# EAGLE design Voltage Converter v1 (EAGLE 6.5.0)
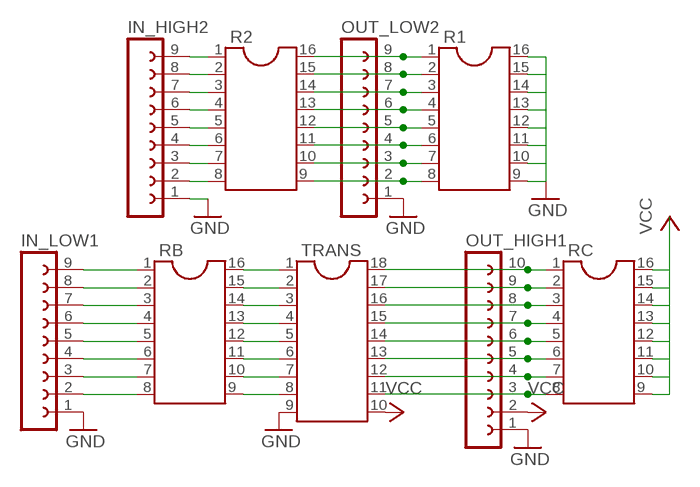
[diagram p0: schematic, sheet 1]

## Parts
IN_HIGH2  FE09-1  [FE09]
IN_LOW1  FE09-1  [FE09]
OUT_HIGH1  FE10-1  [FE10]
OUT_LOW2  FE09-1  [FE09]
R1  DIL16S  [SOCKET-16]
R2  DIL16S  [SOCKET-16]
RB  DIL16S  [SOCKET-16]
RC  DIL16S  [SOCKET-16]
TRANS  DIL18S  [SOCKET-18]

## Nets
GND: IN_HIGH2.1 IN_LOW1.1 OUT_HIGH1.1 OUT_LOW2.1 R1.9 R1.10 R1.11 R1.12 R1.13 R1.14 R1.15 R1.16 TRANS.9
N$1: IN_LOW1.2 RB.8
N$2: IN_LOW1.3 RB.7
N$3: IN_LOW1.4 RB.6
N$4: IN_LOW1.5 RB.5
N$5: IN_LOW1.6 RB.4
N$6: IN_LOW1.7 RB.3
N$7: IN_LOW1.8 RB.2
N$8: IN_LOW1.9 RB.1
N$9: RB.9 TRANS.8
N$10: RB.10 TRANS.7
N$11: RB.11 TRANS.6
N$12: RB.12 TRANS.5
N$13: RB.13 TRANS.4
N$14: RB.14 TRANS.3
N$15: RB.15 TRANS.2
N$16: RB.16 TRANS.1
N$17: OUT_HIGH1.10 RC.1 TRANS.18
N$18: OUT_HIGH1.9 RC.2 TRANS.17
N$19: OUT_HIGH1.8 RC.3 TRANS.16
N$20: OUT_HIGH1.7 RC.4 TRANS.15
N$21: OUT_HIGH1.6 RC.5 TRANS.14
N$22: OUT_HIGH1.5 RC.6 TRANS.13
N$23: OUT_HIGH1.4 RC.7 TRANS.12
N$24: OUT_HIGH1.3 RC.8 TRANS.11
N$25: IN_HIGH2.2 R2.8
N$26: IN_HIGH2.3 R2.7
N$27: IN_HIGH2.4 R2.6
N$28: IN_HIGH2.5 R2.5
N$29: IN_HIGH2.6 R2.4
N$30: IN_HIGH2.7 R2.3
N$31: IN_HIGH2.8 R2.2
N$32: IN_HIGH2.9 R2.1
N$33: OUT_LOW2.9 R1.1 R2.16
N$34: OUT_LOW2.8 R1.2 R2.15
N$35: OUT_LOW2.7 R1.3 R2.14
N$36: OUT_LOW2.6 R1.4 R2.13
N$37: OUT_LOW2.5 R1.5 R2.12
N$38: OUT_LOW2.4 R1.6 R2.11
N$39: OUT_LOW2.3 R1.7 R2.10
N$40: OUT_LOW2.2 R1.8 R2.9
VCC: OUT_HIGH1.2 RC.9 RC.10 RC.11 RC.12 RC.13 RC.14 RC.15 RC.16 TRANS.10

## Library data of the parts
IN_HIGH2 IN_LOW1 OUT_LOW2 = con-lsta:FE09-1: FEMALE HEADER; OC_FARNELL: unknown; OC_NEWARK: unknown
OUT_HIGH1 = con-lsta:FE10-1: FEMALE HEADER; OC_FARNELL: unknown; OC_NEWARK: unknown
R1 R2 RB RC = ic-package:DIL16: Dual In Line / Socket
TRANS = ic-package:DIL18: Dual In Line / Socket

## Board
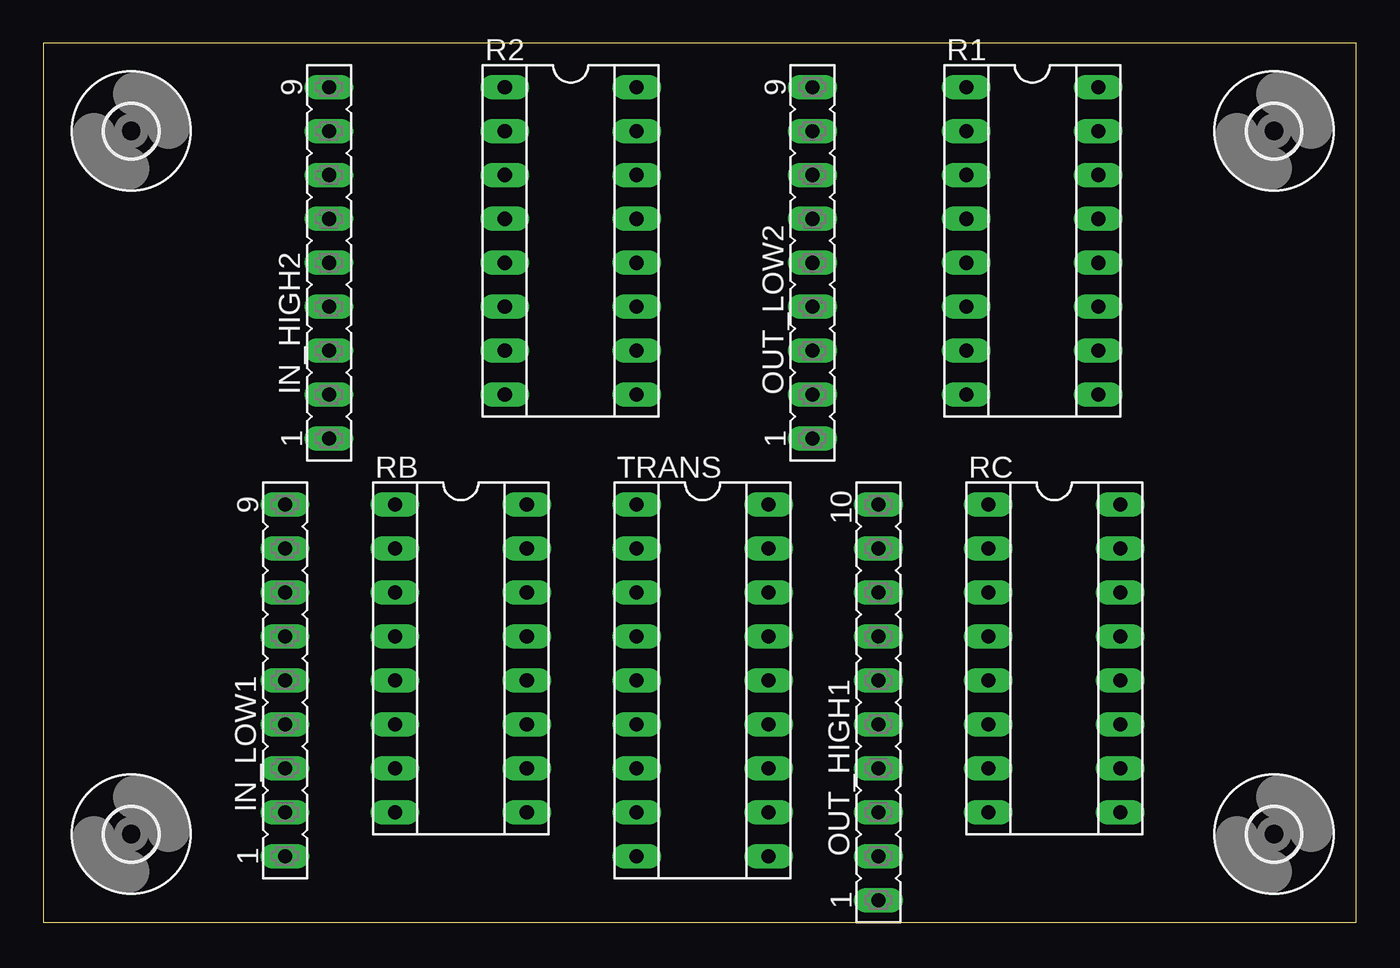
[diagram p1: board, top side]
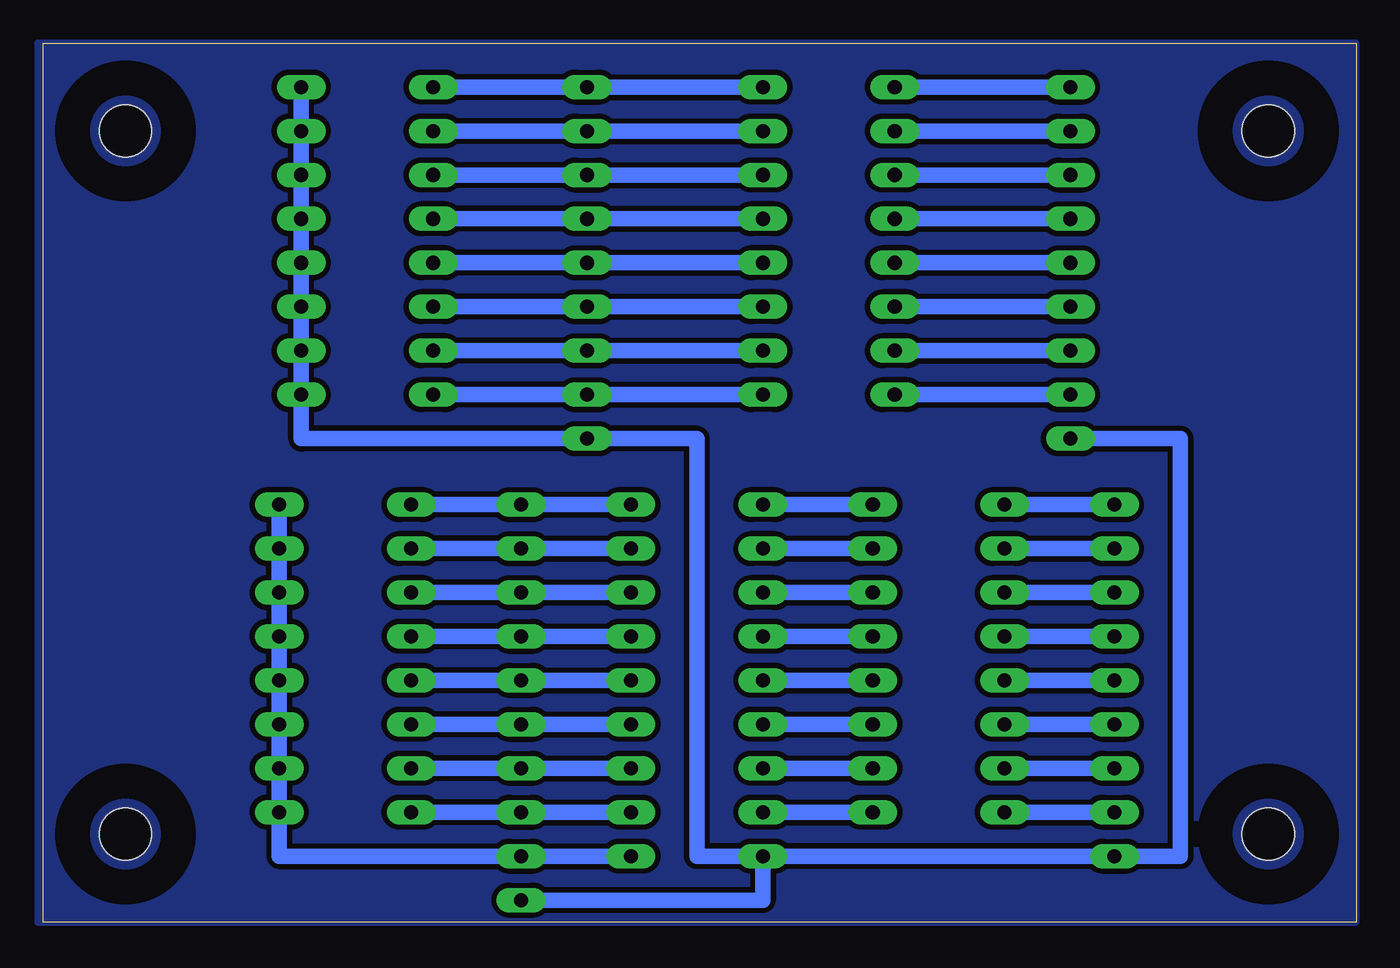
[diagram p2: board, bottom side, seen from below]

Size 75.87 x 50.79 mm. Coordinates in mm from the lower left corner, seen from the top.
Outline: 0,0 75.87,0 75.87,50.79 0,50.79 0,0
Copper layers (1*16): Top 0.035mm / dielectric 1.5mm / Bottom 0.035mm
Design rules "default *": minimum track width 12mil, minimum drill 24mil, track to track 12mil, track to pad 12mil, pad to pad 12mil, via to via 12mil, smd to smd 8mil, copper to edge 0mil, drill to drill 8mil, minimum pad ring 12mil, minimum via ring 12mil, stop-mask expansion 4mil, vias tented up to drill 0mil, thermal gap 10mil
tKeepout: area -1.3,-1.3 to 77.5,52.1
tRestrict: area -1.3,-1.3 to 77.5,52.1

### Footprints (pad centres in the part's own frame; a part is rotated, then mirrored left to right if it is on the bottom)
FE09 = drill 0.813 long: 1 -10.16,0; 2 -7.62,0; 3 -5.08,0; 4 -2.54,0; 5 0,0; 6 2.54,0; 7 5.08,0; 8 7.62,0; 9 10.16,0
FE10 = drill 0.813 long: 1 -11.43,0; 2 -8.89,0; 3 -6.35,0; 4 -3.81,0; 5 -1.27,0; 6 1.27,0; 7 3.81,0; 8 6.35,0; 9 8.89,0; 10 11.43,0
SOCKET-16 = drill 0.813 long: 1 -8.89,-3.81; 2 -6.35,-3.81; 3 -3.81,-3.81; 4 -1.27,-3.81; 5 1.27,-3.81; 6 3.81,-3.81; 7 6.35,-3.81; 8 8.89,-3.81; 9 8.89,3.81; 10 6.35,3.81; 11 3.81,3.81; 12 1.27,3.81; 13 -1.27,3.81; 14 -3.81,3.81; 15 -6.35,3.81; 16 -8.89,3.81
SOCKET-18 = drill 0.813 long: 1 -10.16,-3.81; 2 -7.62,-3.81; 3 -5.08,-3.81; 4 -2.54,-3.81; 5 0,-3.81; 6 2.54,-3.81; 7 5.08,-3.81; 8 7.62,-3.81; 9 10.16,-3.81; 10 10.16,3.81; 11 7.62,3.81; 12 5.08,3.81; 13 2.54,3.81; 14 0,3.81; 15 -2.54,3.81; 16 -5.08,3.81; 17 -7.62,3.81; 18 -10.16,3.81
3,0 = hole 3: 0,0

### Placement (x,y rotation side)
IN_HIGH2  16.51,38.1 90 top
IN_LOW1  13.97,13.97 90 top
OUT_HIGH1  48.26,12.7 90 top
OUT_LOW2  44.45,38.1 90 top
R1  57.15,39.37 270 top
R2  30.48,39.37 270 top
RB  24.13,15.24 270 top
RC  58.42,15.24 270 top
TRANS  38.1,13.97 270 top
U$1  [3,0]  5.08,5.08 0 top
U$2  [3,0]  5.08,45.72 0 top
U$3  [3,0]  71.12,5.08 0 top
U$4  [3,0]  71.12,45.72 0 top

### Tracks (layer width: path | path; a pad name or v marks a point on that pad's centre or on a via)
GND
  Bottom 0.889: IN_HIGH2.1 10.16,27.94 10.16,3.81 IN_LOW1.1 TRANS.9 | TRANS.9 34.29,1.27 OUT_HIGH1.1 | TRANS.9 38.1,3.81 38.1,27.94 OUT_LOW2.1 60.96,27.94 R1.9 R1.10 R1.11 R1.12 R1.13 R1.14 R1.15 R1.16
N$1
  Bottom 0.889: RB.8 IN_LOW1.2
N$2
  Bottom 0.889: RB.7 IN_LOW1.3
N$3
  Bottom 0.889: RB.6 IN_LOW1.4
N$4
  Bottom 0.889: RB.5 IN_LOW1.5
N$5
  Bottom 0.889: RB.4 IN_LOW1.6
N$6
  Bottom 0.889: RB.3 IN_LOW1.7
N$7
  Bottom 0.889: RB.2 IN_LOW1.8
N$8
  Bottom 0.889: RB.1 IN_LOW1.9
N$9
  Bottom 0.889: TRANS.8 RB.9
N$10
  Bottom 0.889: TRANS.7 RB.10
N$11
  Bottom 0.889: TRANS.6 RB.11
N$12
  Bottom 0.889: TRANS.5 RB.12
N$13
  Bottom 0.889: TRANS.4 RB.13
N$14
  Bottom 0.889: TRANS.3 RB.14
N$15
  Bottom 0.889: TRANS.2 RB.15
N$16
  Bottom 0.889: TRANS.1 RB.16
N$17
  Bottom 0.889: TRANS.18 OUT_HIGH1.10 RC.1
N$18
  Bottom 0.889: TRANS.17 OUT_HIGH1.9 RC.2
N$19
  Bottom 0.889: TRANS.16 OUT_HIGH1.8 RC.3
N$20
  Bottom 0.889: TRANS.15 OUT_HIGH1.7 RC.4
N$21
  Bottom 0.889: TRANS.14 OUT_HIGH1.6 RC.5
N$22
  Bottom 0.889: TRANS.13 OUT_HIGH1.5 RC.6
N$23
  Bottom 0.889: TRANS.12 OUT_HIGH1.4 RC.7
N$24
  Bottom 0.889: TRANS.11 OUT_HIGH1.3 RC.8
N$25
  Bottom 0.889: R2.8 IN_HIGH2.2
N$26
  Bottom 0.889: R2.7 IN_HIGH2.3
N$27
  Bottom 0.889: R2.6 IN_HIGH2.4
N$28
  Bottom 0.889: R2.5 IN_HIGH2.5
N$29
  Bottom 0.889: R2.4 IN_HIGH2.6
N$30
  Bottom 0.889: R2.3 IN_HIGH2.7
N$31
  Bottom 0.889: R2.2 IN_HIGH2.8
N$32
  Bottom 0.889: R2.1 IN_HIGH2.9
N$33
  Bottom 0.889: R2.16 OUT_LOW2.9 R1.1
N$34
  Bottom 0.889: R2.15 OUT_LOW2.8 R1.2
N$35
  Bottom 0.889: R2.14 OUT_LOW2.7 R1.3
N$36
  Bottom 0.889: R2.13 OUT_LOW2.6 R1.4
N$37
  Bottom 0.889: R2.12 OUT_LOW2.5 R1.5
N$38
  Bottom 0.889: R2.11 OUT_LOW2.4 R1.6
N$39
  Bottom 0.889: R2.10 OUT_LOW2.3 R1.7
N$40
  Bottom 0.889: R2.9 OUT_LOW2.2 R1.8
N$41
  pour Bottom: 0,0 0,50.8 76.2,50.8 76.2,0
VCC
  Bottom 0.889: TRANS.10 OUT_HIGH1.2 62.23,3.81 RC.9 RC.10 RC.11 RC.12 RC.13 RC.14 RC.15 RC.16